# EAGLE schematic Overvoltage Protection (EAGLE 7.6.0)
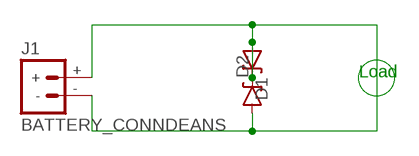
[diagram p0: schematic, sheet 1]

## Parts
D1  DIODE-ZENERPTH  [DIODE-ZENER]
D2  DIODE-ZENERPTH  [DIODE-ZENER]
J1  BATTERY_CONNDEANS  [DEANS]

## Nets
N$1: D1.P$1(C) D1.P$2(A) D2.P$1(C) D2.P$2(A) J1.+ J1.-

## Notes on the sheet
- Load

## Library data of the parts
D1 D2 = SparkFun-DiscreteSemi:DIODE-ZENER: Zener Diode Production Part - 8199 3.4V Zener Voltage
J1 = SparkFun-Connectors:BATTERY_CONN: Various footprints for battery connectors